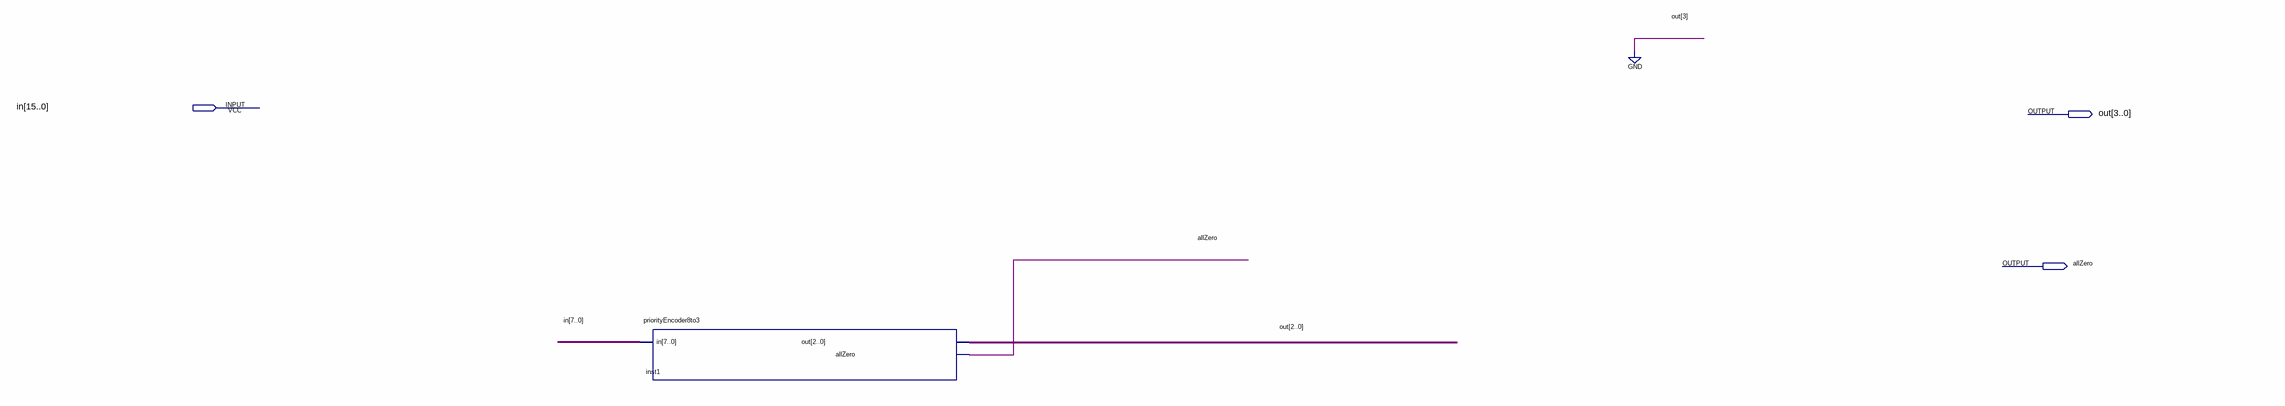
[diagram p0: schematic sheet]
// Quartus schematic priorityEncoder16to4(special).bdf as structural Verilog: 1 symbols, 3 pins
module \priorityEncoder16to4(special)  (
  input  [15:0] in,
  output [3:0] out,
  output allZero
);

  priorityEncoder8to3 inst1 (.in(in[7:0]), .out(out[2:0]), .allZero(allZero));

  assign out[3] = 1'b0;
endmodule
